# Altium schematic sheet rsx_low_power_board_12V.SchDoc
size A4
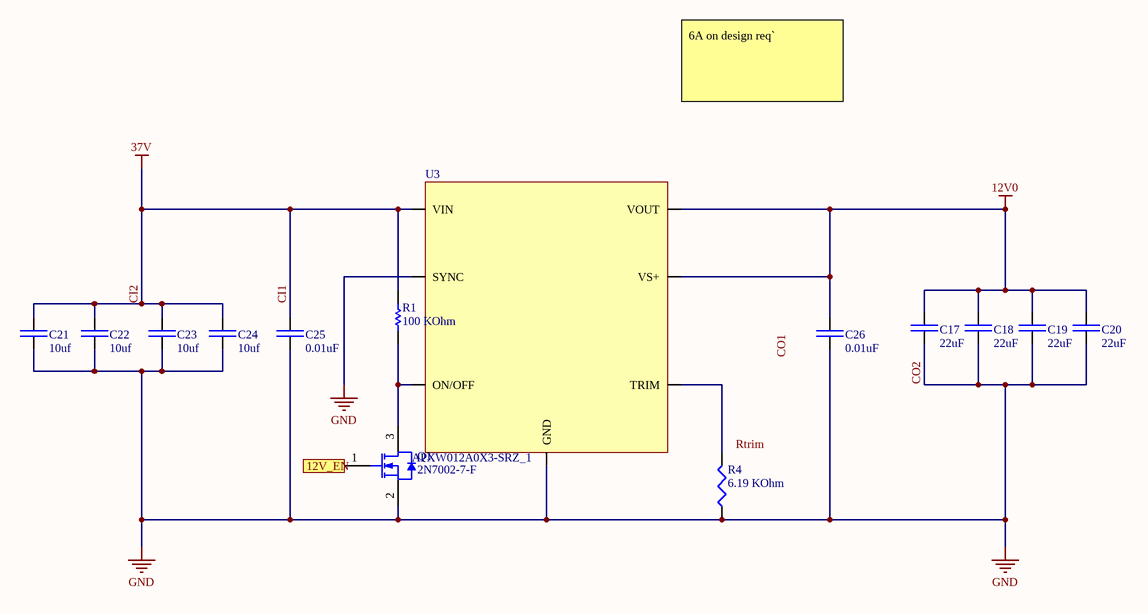
[diagram p0: rsx_low_power_board_12V.SchDoc]

## Parts
C17  22uF  [22uF Capacitor]
C18  22uF  [22uF Capacitor]
C19  22uF  [22uF Capacitor]
C20  22uF  [22uF Capacitor]
C21  10uf  [10uF capacitor LPB]
C22  10uf  [10uF capacitor LPB]
C23  10uf  [10uF capacitor LPB]
C24  10uf  [10uF capacitor LPB]
C25  0.01uF  [0.01uF capacitor]
C26  0.01uF  [0.01uF capacitor]
Q1  2N7002-7-F  [DIOD-SOT23-3_V]
R1  100 KOhm  [RESC1609X55X30ML10T20]
R4  6.19 KOhm  [6.19KOhm Resistor]
U3  APXW012A0X3-SRZ_1  [DC-DC Buck converter]

## Ports
12V_EN (in)

## Nets
12V0: C17.2 C18.2 C19.2 C20.2 C26.2 U3.3(VS+) U3.5(VOUT)
CI1: C21.2 C22.2 C23.2 C24.2 C25.2 R1.2 U3.7(VIN)  [also labelled 37V, CI2]
CO2: C17.1 C18.1 C19.1 C20.1 C21.1 C22.1 C23.1 C24.1 C25.1 C26.1 Q1.2(S) R4.1 U3.2(GND) U3.6(SYNC)  [also labelled GND]
12V_EN: Q1.1(G) ; port 12V_EN
NetQ1_3: Q1.3(D) R1.1 U3.1(ON/OFF)
NetR4_2: R4.2 U3.4(TRIM)

## Notes on the sheet
- 6A on design req`
- Labels drawn without touching a wire or pin: CO1, Rtrim

## Library data of the parts
C17-C20 = GRM32ER71E226KE15L: Cap Ceramic 22uF 25V X7R 10% SMD 1210 125C Embossed T/R; Manufacturer 1: Murata; Supplier 1: Digi-Key; Supplier Part Number 1: 490-5313-6-ND; Manufacturer Part Number 1: GRM32ER71E226KE15L; Stock 1: 52660; Pricing 1: 1=1,78000, 10=1,40600, 100=1,05410, 500=0,79646 (USD); RoHS: Yes; Mount: Surface Mount; Case/Package: 1210; Number of Pins: 2; Case Code (Metric): 3225; Case Code (Imperial): 1210; Material: Ceramic; Min Operating Temperature: -55°C; Max Operating Temperature: 125°C; Capacitance: 22uF; Tolerance: 10%; Dielectric: X7R; Voltage Rating: 25V; Packaging: Tape and Reel; Package Quantity: 1; Voltage Rating (DC): 25V; Termination: SMD/SMT; Voltage: 25V; Length: 3.2mm; Height: 2.5mm; Width: 0.098inch; Thickness: 0.106inch; Depth: 2.5mm; Radiation Hardening: No; REACH SVHC: No SVHC; Lead Free: Lead Free; ComponentLink1URL: https://datasheet.ciiva.com/6072/1697714-6072768.pdf?src-supplier=Farnell; ComponentLink1Description: https://datasheet.ciiva.com/6072/1697714-6072768.pdf?src-supplier=Farnell; ComponentLink2URL: https://datasheet.ciiva.com/16497/product-16497009.pdf?src-supplier=Future+Electronics; ComponentLink2Description: https://datasheet.ciiva.com/16497/product-16497009.pdf?src-supplier=Future+Electronics; ComponentLink3URL: https://datasheet.ciiva.com/3776/2741grm32er71e226ke1523-3776996.pdf?src-supplier=Arrow; ComponentLink3Description: https://datasheet.ciiva.com/3776/2741grm32er71e226ke1523-3776996.pdf?src-supplier=Arrow; ComponentLink4URL: https://datasheet.ciiva.com/11789/0900766b80ef921d-11789129.pdf?src-supplier=RSComponents; ComponentLink4Description: https://datasheet.ciiva.com/11789/0900766b80ef921d-11789129.pdf?src-supplier=RSComponents; ComponentLink5URL: https://datasheet.ciiva.com/29201/451826-da-01-de-vs-kondens-grm32-er71e-226ke15l-29201795.pdf?src-supplier=Conrad; ComponentLink5Description: https://datasheet.ciiva.com/29201/451826-da-01-de-vs-kondens-grm32-er71e-226ke15l-29201795.pdf?src-supplier=Conrad; ComponentLink6URL: https://datasheet.ciiva.com/175/partnumbering-e-01-175746.pdf?src-supplier=Digi-Key; ComponentLink6Description: https://datasheet.ciiva.com/175/partnumbering-e-01-175746.pdf?src-supplier=Digi-Key; ComponentLink7URL: https://datasheet.ciiva.com/175/partnumbering-e-01-175747.pdf?src-supplier=Digi-Key; ComponentLink7Description: https://datasheet.ciiva.com/175/partnumbering-e-01-175747.pdf?src-supplier=Digi-Key; ComponentLink8URL: https://datasheet.ciiva.com/175/partnumbering-e-01-175748.pdf?src-supplier=Digi-Key; ComponentLink8Description: https://datasheet.ciiva.com/175/partnumbering-e-01-175748.pdf?src-supplier=Digi-Key; ComponentLink9URL: https://datasheet.ciiva.com/22703/1697714-22703397.pdf?src-supplier=Element14; ComponentLink9Description: https://datasheet.ciiva.com/22703/1697714-22703397.pdf?src-supplier=Element14; Category: Capacitor
C21-C24 = GRT31CR61H106ME01L: CAP CER 10UF 50V X5R 1206; Manufacturer 1: Murata; Tolerance: 20%; Supplier 1: Digi-Key; Supplier Part Number 1: 490-12457-1-ND; Manufacturer Part Number 1: GRT31CR61H106ME01L; Stock 1: 8159; Pricing 1: 1=0,50000, 10=0,34900, 100=0,20920, 500=0,15690, 1000=0,13249 (USD); RoHS: Yes; Mount: Surface Mount; Case/Package: 1206; Case Code (Metric): 3216; Case Code (Imperial): 1206; Min Operating Temperature: -55°C; Max Operating Temperature: 85°C; Packaging: Tape and Reel; Capacitance: 10uF; Voltage Rating: 50V; Length: 0.126inch; Width: 0.063inch; Thickness: 0.071inch; Ratings: AEC-Q200; ComponentLink1URL: http://search.murata.co.jp/Ceramy/image/img/A01X/G101/ENG/GRT31CR61H106ME01-01.pdf?src-supplier=Digi-Key; ComponentLink1Description: http://search.murata.co.jp/Ceramy/image/img/A01X/G101/ENG/GRT31CR61H106ME01-01.pdf?src-supplier=Digi-Key; Category: Capacitor
C25 C26 = C0603C103KARACAUTO: Cap Ceramic 0.01uF 250V X7R 10% Pad SMD 0603 125C Automotive T/R; Manufacturer 1: KEMET; Capacitance: 10nF; Supplier 1: Digi-Key; Supplier Part Number 1: 399-17960-1-ND; Manufacturer Part Number 1: C0603C103KARACAUTO; Stock 1: 8483; Pricing 1: 1=0,90000, 10=0,68500, 100=0,49040, 500=0,37964, 1000=0,32691 (USD); RoHS: No; Mount: Surface Mount; Case/Package: 0603; Case Code (Imperial): 0603; Case Code (Metric): 1608; Min Operating Temperature: -55°C; Max Operating Temperature: 125°C; Packaging: Tape and Reel; Tolerance: 10%; Voltage Rating: 250V; Ratings: AEC-Q200; ComponentLink1URL: https://api.kemet.com/component-edge/download/datasheet/C0603C103KARACAUTO.pdf?src-supplier=Digi-Key; ComponentLink1Description: https://api.kemet.com/component-edge/download/datasheet/C0603C103KARACAUTO.pdf?src-supplier=Digi-Key; Category: Capacitor
Q1 = CMP-2000-04929-1: N-Channel Enhancement Mode Field Effect Transistor, 60 V, 0.115 A, -55 to 150 degC, 3-Pin SOT23, RoHS, Tape and Reel; Id - Continuous Drain Current: 115mA; Typical Turn-On Delay Time: 7ns; Typical Turn-Off Delay Time: 11ns; Brand: DiodesIncorporated; Transistor Type: 1N-Channel; Vgs - Gate-Source Voltage: 20V; Rise Time: 3ns; Configuration: Single; Fall Time: 5.6ns; Vds - Drain-Source Breakdown Voltage: 70V; Rds On - Drain-Source Resistance: 7.5Ohms; Number of Channels: 1Channel; Forward Transconductance - Min: 0.08S; Pd - Power Dissipation: 300mW; Unit Weight: 0.000282oz; Datasheet URL: http://datasheet.octopart.com/2N7002-7-F-Diodes-Inc.-datasheet-8326113.pdf; Width: 1.3mm; Series: 2N7002; Length: 2.9mm; Product Category: MOSFET; Minimum Operating Temperature: -55C; Manufacturer URL: http://www.diodes.com/; Mounting Style: SMD/SMT; Package Reference: SOT23-3; Package Description: 3-Pin Small Outline Transistor, Body 2.9 x 1.3 mm, Pitch 0.96 mm; Maximum Operating Temperature: +150C; Transistor Polarity: N-Channel; Factory Pack Quantity: 3000; Technology: Si; Channel Mode: Enhancement; Datasheet Version: Rev. 21-2, 02/2009; Type: EnhancementModeFieldEffectTransistor; RoHS: True; Packaging: Reel; Package / Case: SOT-23-3; Height: 1mm; Product: MOSFETSmallSignal; Manufacturer: DiodesIncorporated
R1 = CMP-2000-03816-1: Part Number: CRCW06030000Z0EA; Manufacturer: Vishay Dale
R4 = ERA3AEB6191V: RES SMD 6.19KOHM 0.1% 1/10W 0603; Manufacturer 1: Panasonic; Resistance: 6.19kR; Power Rating: 100mW; Voltage Rating: 75V; Temperature Coefficient: 25ppm/°C; Supplier 1: Digi-Key; Supplier Part Number 1: P6.19KDBCT-ND; Manufacturer Part Number 1: ERA3AEB6191V; Stock 1: 26110; Pricing 1: 1=0,35000, 10=0,30000, 100=0,11720, 1000=0,04906, 2500=0,04498 (USD); RoHS: Yes; Mount: Surface Mount; Case/Package: 0603; Number of Pins: 2; Case Code (Imperial): 0603; Case Code (Metric): 1608; Contact Plating: Tin; Min Operating Temperature: -55°C; Max Operating Temperature: 155°C; Tolerance: 0.1%; Packaging: Tape and Reel; Package Quantity: 1; Composition: Metal Film,Thin Film; Number of Terminations: 2; Military Standard: Not; Max Power Dissipation: 100mW; Voltage Rating (DC): 75V; Features: Automotive AEC-Q200; Length: 1.6mm; Height: 0.45mm; Width: 0.8mm; Depth: 0.8mm; Radiation Hardening: No; REACH SVHC: No SVHC; Lead Free: Lead Free; ComponentLink1URL: https://datasheet.ciiva.com/11809/0900766b80eb1d8c-11809038.pdf?src-supplier=RSComponents; ComponentLink1Description: https://datasheet.ciiva.com/11809/0900766b80eb1d8c-11809038.pdf?src-supplier=RSComponents; ComponentLink2URL: https://datasheet.ciiva.com/5971/485442-5971798.pdf?src-supplier=Farnell; ComponentLink2Description: https://datasheet.ciiva.com/5971/485442-5971798.pdf?src-supplier=Farnell; ComponentLink3URL: https://datasheet.ciiva.com/24026/aoa0000ce26-32660-24026983.pdf?src-supplier=Mouser; ComponentLink3Description: https://datasheet.ciiva.com/24026/aoa0000ce26-32660-24026983.pdf?src-supplier=Mouser; ComponentLink4URL: https://datasheet.ciiva.com/46447/485442-46447114.pdf?src-supplier=Element14; ComponentLink4Description: https://datasheet.ciiva.com/46447/485442-46447114.pdf?src-supplier=Element14; ComponentLink5URL: https://datasheet.ciiva.com/43457/485442-43457243.pdf?src-supplier=Farnell; ComponentLink5Description: https://datasheet.ciiva.com/43457/485442-43457243.pdf?src-supplier=Farnell; ComponentLink6URL: https://datasheet.ciiva.com/46447/485442-46447115.pdf?src-supplier=Element14; ComponentLink6Description: https://datasheet.ciiva.com/46447/485442-46447115.pdf?src-supplier=Element14; ComponentLink7URL: https://datasheet.ciiva.com/41450/001180853-da-01-en-widerstand-era-0603-6k19-0-1-5000st-41450170.pdf?src-supplier=Conrad; ComponentLink7Description: https://datasheet.ciiva.com/41450/001180853-da-01-en-widerstand-era-0603-6k19-0-1-5000st-41450170.pdf?src-supplier=Conrad
U3 = APXW012A0X3-SRZ_1: DC DC CONVERTER 3-18V 12A; Manufacturer 1: GE; Number of Outputs: 1; Min Input Voltage: 9V; Max Input Voltage: 36V; Voltage - Output 1: 18V; Efficiency: 95.5%; Supplier 1: Avnet; Supplier Part Number 1: 150028492; Manufacturer Part Number 1: APXW012A0X3-SRZ; Stock 1: 0; RoHS: Yes; Mount: Surface Mount; Case/Package: Module; Number of Pins: 9; Min Operating Temperature: -40°C; Max Operating Temperature: 85°C; Packaging: Tape and Reel; Max Output Current: 12A; Current - Output 1: 12A; Package Quantity: 140; Output Current: 12A; Output Voltage: 18V; Features: OCP,OTP; Length: 1.3inch; Height: 0.39inch; Width: 0.53inch; ComponentLink1URL: http://apps.geindustrial.com/publibrary/checkout/DS-APXW012?TNR=Data%20Sheets&src-supplier=Avnet; ComponentLink1Description: http://apps.geindustrial.com/publibrary/checkout/DS-APXW012?TNR=Data%20Sheets&src-supplier=Avnet; ComponentLink2URL: http://apps.geindustrial.com/publibrary/checkout/DS-APXW012?TNR=Data%20Sheets|DS-APXW012|generic&src-supplier=Digi-Key; ComponentLink2Description: http://apps.geindustrial.com/publibrary/checkout/DS-APXW012?TNR=Data%20Sheets|DS-APXW012|generic&src-supplier=Digi-Key; ComponentLink3URL: http://apps.geindustrial.com/publibrary/checkout/DS-APXW012?TNR=Data%20Sheets%7CDS-APXW012%7Cgeneric&src-supplier=Mouser; ComponentLink3Description: http://apps.geindustrial.com/publibrary/checkout/DS-APXW012?TNR=Data%20Sheets%7CDS-APXW012%7Cgeneric&src-supplier=Mouser; Category: Buck Converter